# EAGLE design power_supply_board (EAGLE 6.1)
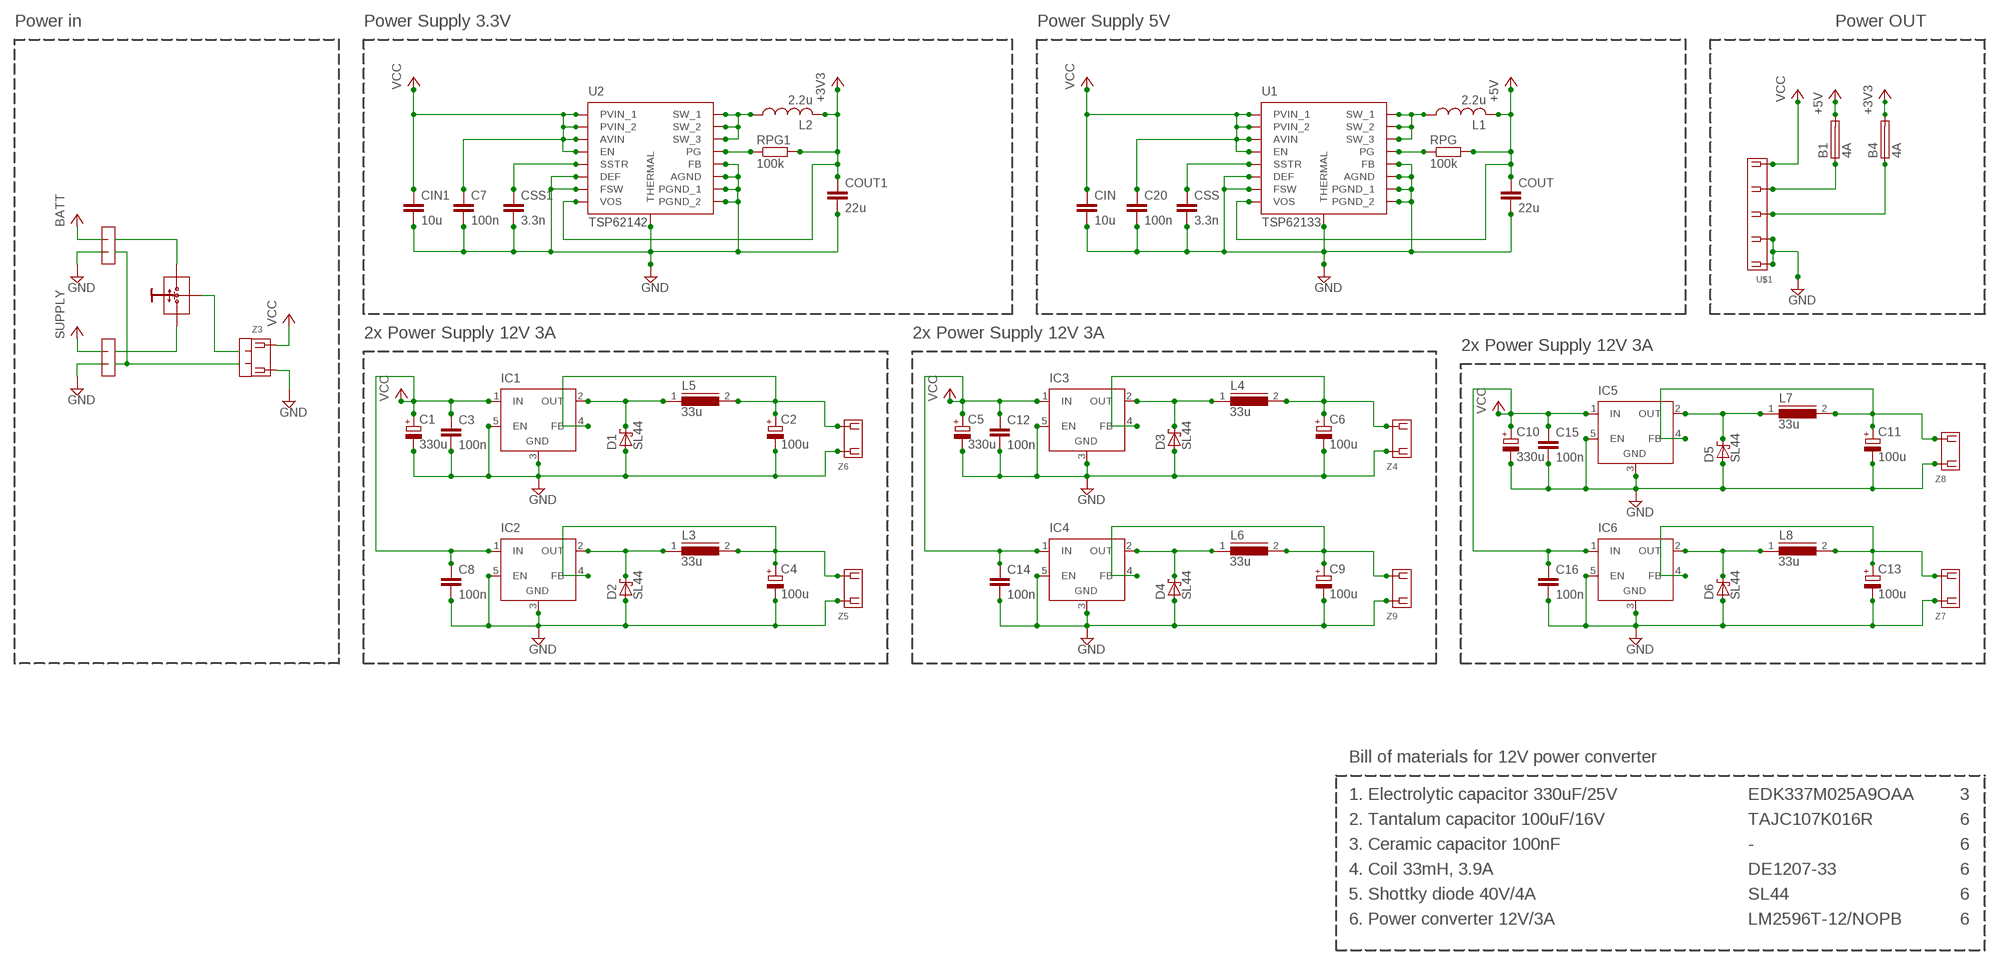
[diagram p0: schematic, sheet 1]

## Parts
B1  4A  FUSE_1206  [1206]
B4  4A  FUSE_1206  [1206]
C1  330u  CPOL-EU150CLZ-1010  [150CLZ-1010]
C2  100u  CPOL-EUSMCC  [SMC_C]
C3  100n  C-EUC0805  [C0805]
C4  100u  CPOL-EUSMCC  [SMC_C]
C5  330u  CPOL-EU150CLZ-1010  [150CLZ-1010]
C6  100u  CPOL-EUSMCC  [SMC_C]
C7  100n  C-EUC0805  [C0805]
C8  100n  C-EUC0805  [C0805]
C9  100u  CPOL-EUSMCC  [SMC_C]
C10  330u  CPOL-EU150CLZ-1010  [150CLZ-1010]
C11  100u  CPOL-EUSMCC  [SMC_C]
C12  100n  C-EUC0805  [C0805]
C13  100u  CPOL-EUSMCC  [SMC_C]
C14  100n  C-EUC0805  [C0805]
C15  100n  C-EUC0805  [C0805]
C16  100n  C-EUC0805  [C0805]
C20  100n  C-EUC0805  [C0805]
CIN  10u  C-EUC0805  [C0805]
CIN1  10u  C-EUC0805  [C0805]
COUT  22u  C-EUC0805  [C0805]
COUT1  22u  C-EUC0805  [C0805]
CSS  3.3n  C-EUC0805  [C0805]
CSS1  3.3n  C-EUC0805  [C0805]
D1  SL44  SCHOTTKY-DIODESMC  [SMC]
D2  SL44  SCHOTTKY-DIODESMC  [SMC]
D3  SL44  SCHOTTKY-DIODESMC  [SMC]
D4  SL44  SCHOTTKY-DIODESMC  [SMC]
D5  SL44  SCHOTTKY-DIODESMC  [SMC]
D6  SL44  SCHOTTKY-DIODESMC  [SMC]
IC1  LM2596TV  [TO220-51]
IC2  LM2596TV  [TO220-51]
IC3  LM2596TV  [TO220-51]
IC4  LM2596TV  [TO220-51]
IC5  LM2596TV  [TO220-51]
IC6  LM2596TV  [TO220-51]
L1  2.2u  L-USWE-TPC  [POWER-CHOKE_WE-TPC]
L2  2.2u  L-USWE-TPC  [POWER-CHOKE_WE-TPC]
L3  33u  DR127  [DR127]
L4  33u  DR127  [DR127]
L5  33u  DR127  [DR127]
L6  33u  DR127  [DR127]
L7  33u  DR127  [DR127]
L8  33u  DR127  [DR127]
RPG  100k  R-EU_R0805  [R0805]
RPG1  100k  R-EU_R0805  [R0805]
U1  TSP62133  [TSP62133]
U2  TSP62142  [TSP62142]
U$1  MOLEX-5268-05  [MOLEX-5268-05]
Z3  2EDGRC-5  [2EDGRC-5]
Z4  MOLEX-5268-02  [MOLEX-5268-02]
Z5  MOLEX-5268-02  [MOLEX-5268-02]
Z6  MOLEX-5268-02  [MOLEX-5268-02]
Z7  MOLEX-5268-02  [MOLEX-5268-02]
Z8  MOLEX-5268-02  [MOLEX-5268-02]
Z9  MOLEX-5268-02  [MOLEX-5268-02]

## Nets
12V3A_1: C2.+ IC1.4(FB) L5.2 Z6.P$2
12V3A_2: C4.+ IC2.4(FB) L3.2 Z5.P$2
12V3A_3: C6.+ IC3.4(FB) L4.2 Z4.P$2
12V3A_4: C9.+ IC4.4(FB) L6.2 Z9.P$2
12V3A_5: C11.+ IC5.4(FB) L7.2 Z8.P$2
12V3A_6: C13.+ IC6.4(FB) L8.2 Z7.P$2
+3V3: B4.2 COUT1.1 L2.2 RPG1.2 U2.VOS
+5V: B1.2 COUT.1 L1.2 RPG.2 U1.VOS
GND: C1.- C2.- C3.2 C4.- C5.- C6.- C7.2 C8.2 C9.- C10.- C11.- C12.2 C13.- C14.2 C15.2 C16.2 C20.2 CIN1.2 CIN.2 COUT1.2 COUT.2 CSS1.2 CSS.2 D1.A D2.A D3.A D4.A D5.A D6.A IC1.3(GND) IC1.5(EN) IC2.3(GND) IC2.5(EN) IC3.3(GND) IC3.5(EN) IC4.3(GND) IC4.5(EN) IC5.3(GND) IC5.5(EN) IC6.3(GND) IC6.5(EN) U1.AGND U1.DEF U1.FB U1.FSW U1.PGND_1 U1.PGND_2 U1.THERMAL U2.AGND U2.DEF U2.FB U2.FSW U2.PGND_1 U2.PGND_2 U2.THERMAL U$1.P$1 U$1.P$2 Z3.P$2 Z4.P$1 Z5.P$1 Z6.P$1 Z7.P$1 Z8.P$1 Z9.P$1
N$1: CSS.1 U1.SSTR
N$2: L2.1 U2.SW_1 U2.SW_2 U2.SW_3
N$3: RPG1.1 U2.PG
N$4: CSS1.1 U2.SSTR
N$5: D2.C IC2.2(OUT) L3.1
N$6: D3.C IC3.2(OUT) L4.1
N$7: L1.1 U1.SW_1 U1.SW_2 U1.SW_3
N$8: D4.C IC4.2(OUT) L6.1
N$9: RPG.1 U1.PG
N$10: D5.C IC5.2(OUT) L7.1
N$11: D6.C IC6.2(OUT) L8.1
N$30: D1.C IC1.2(OUT) L5.1
N$39: B1.1 U$1.P$4
N$42: B4.1 U$1.P$3
VCC: C1.+ C3.1 C5.+ C7.1 C8.1 C10.+ C12.1 C14.1 C15.1 C16.1 C20.1 CIN1.1 CIN.1 IC1.1(IN) IC2.1(IN) IC3.1(IN) IC4.1(IN) IC5.1(IN) IC6.1(IN) U1.AVIN U1.EN U1.PVIN_1 U1.PVIN_2 U2.AVIN U2.EN U2.PVIN_1 U2.PVIN_2 U$1.P$5 Z3.P$1 ; supply symbol labelled BATT, SUPPLY

## Notes on the sheet
- Power in | Power Supply 3.3V | Power Supply 5V | Power OUT
- 2x Power Supply 12V 3A | 2x Power Supply 12V 3A
- 2x Power Supply 12V 3A
- Bill of materials for 12V power converter
- 1. Electrolytic capacitor 330uF/25V | EDK337M025A9OAA | 3
- 2. Tantalum capacitor 100uF/16V | TAJC107K016R | 6
- 3. Ceramic capacitor 100nF | - | 6
- 4. Coil 33mH, 3.9A | DE1207-33 | 6
- 5. Shottky diode 40V/4A | SL44 | 6
- 6. Power converter 12V/3A | LM2596T-12/NOPB | 6

## Library data of the parts
B1 B4 = FUSE_SMD:FUSE_1206
C1 C2 C4-C6 C9-C11 C13 = rcl:CPOL-EU: POLARIZED CAPACITOR, European symbol
C3 C7 C8 C12 C14-C16 C20 CIN CIN1 COUT COUT1 CSS CSS1 = rcl:C-EU: CAPACITOR, European symbol
D1-D6 = diode:SCHOTTKY-DIODE: Schottky Diode
IC1-IC6 = linear:LM2596T: STEP-DOWN VOLTAGE REGULATOR
L1 L2 = rcl:L-US: INDUCTOR, American symbol
L3-L8 = inductors:DR127: High Power Density, High Efficiency, Shielded Inductors Source: coiltronics_dr_series.pdf
RPG RPG1 = rcl:R-EU_: RESISTOR, European symbol
U1 = !tsp:TSP62133
U2 = !tsp:TSP62142
U$1 = MOLEX-5268:MOLEX-5268-05
Z3 = 2EDGRC-5:2EDGRC-5
Z4-Z9 = MOLEX-5268:MOLEX-5268-02

## Board
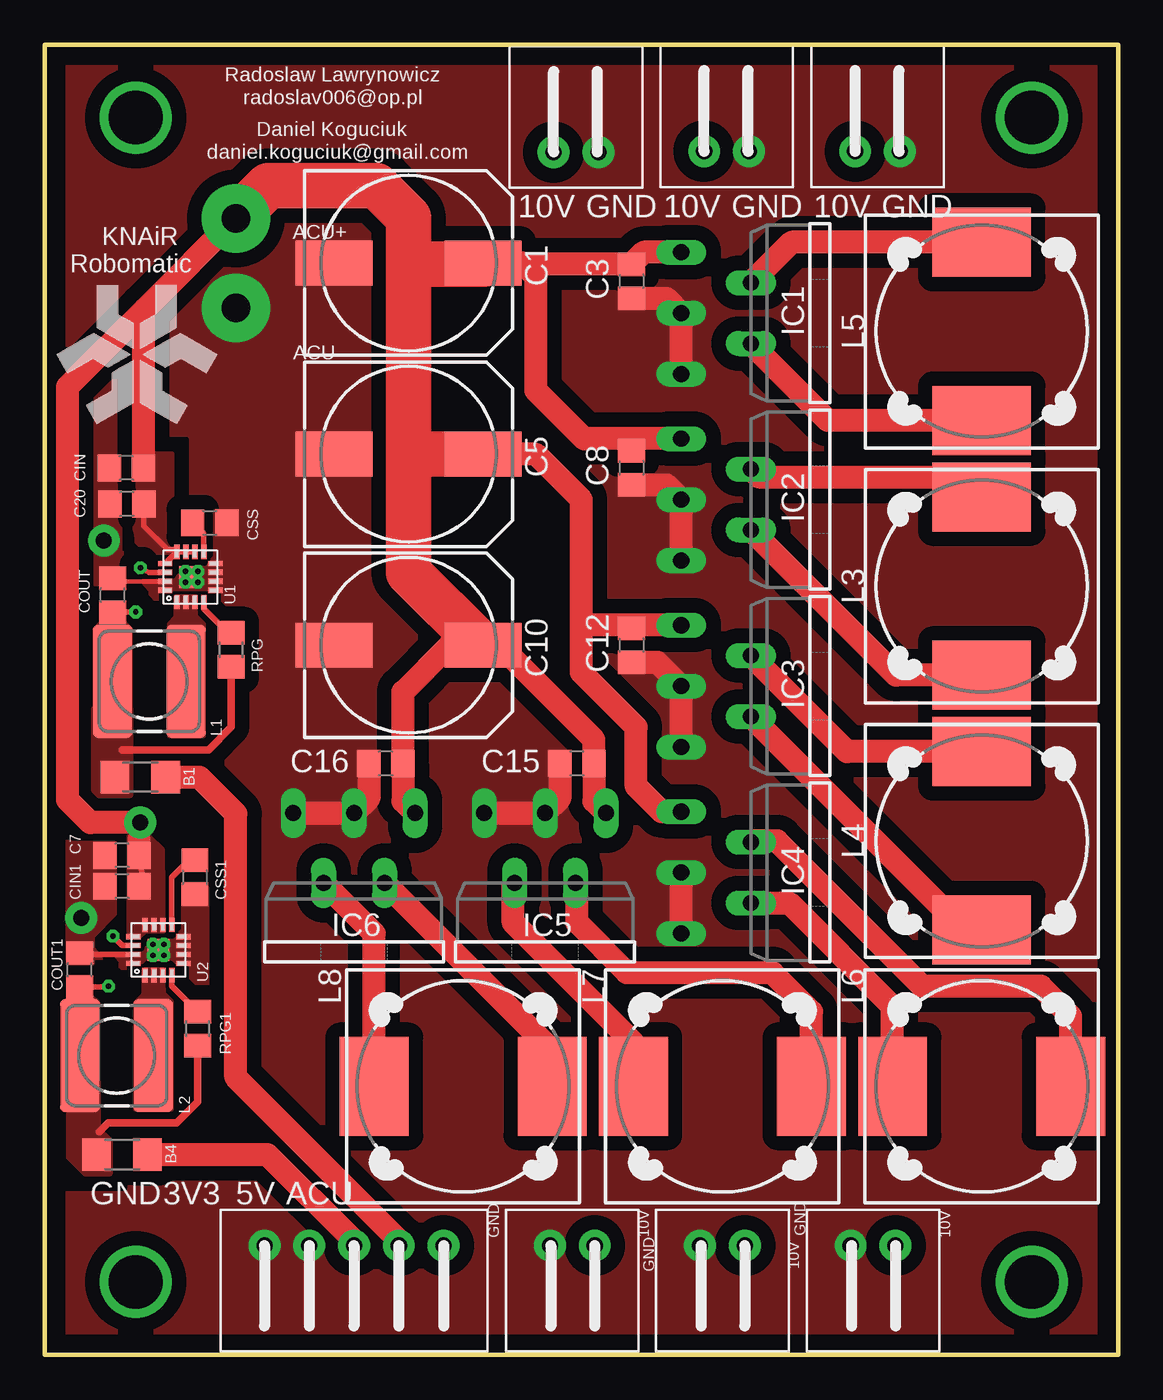
[diagram p1: board, top side]
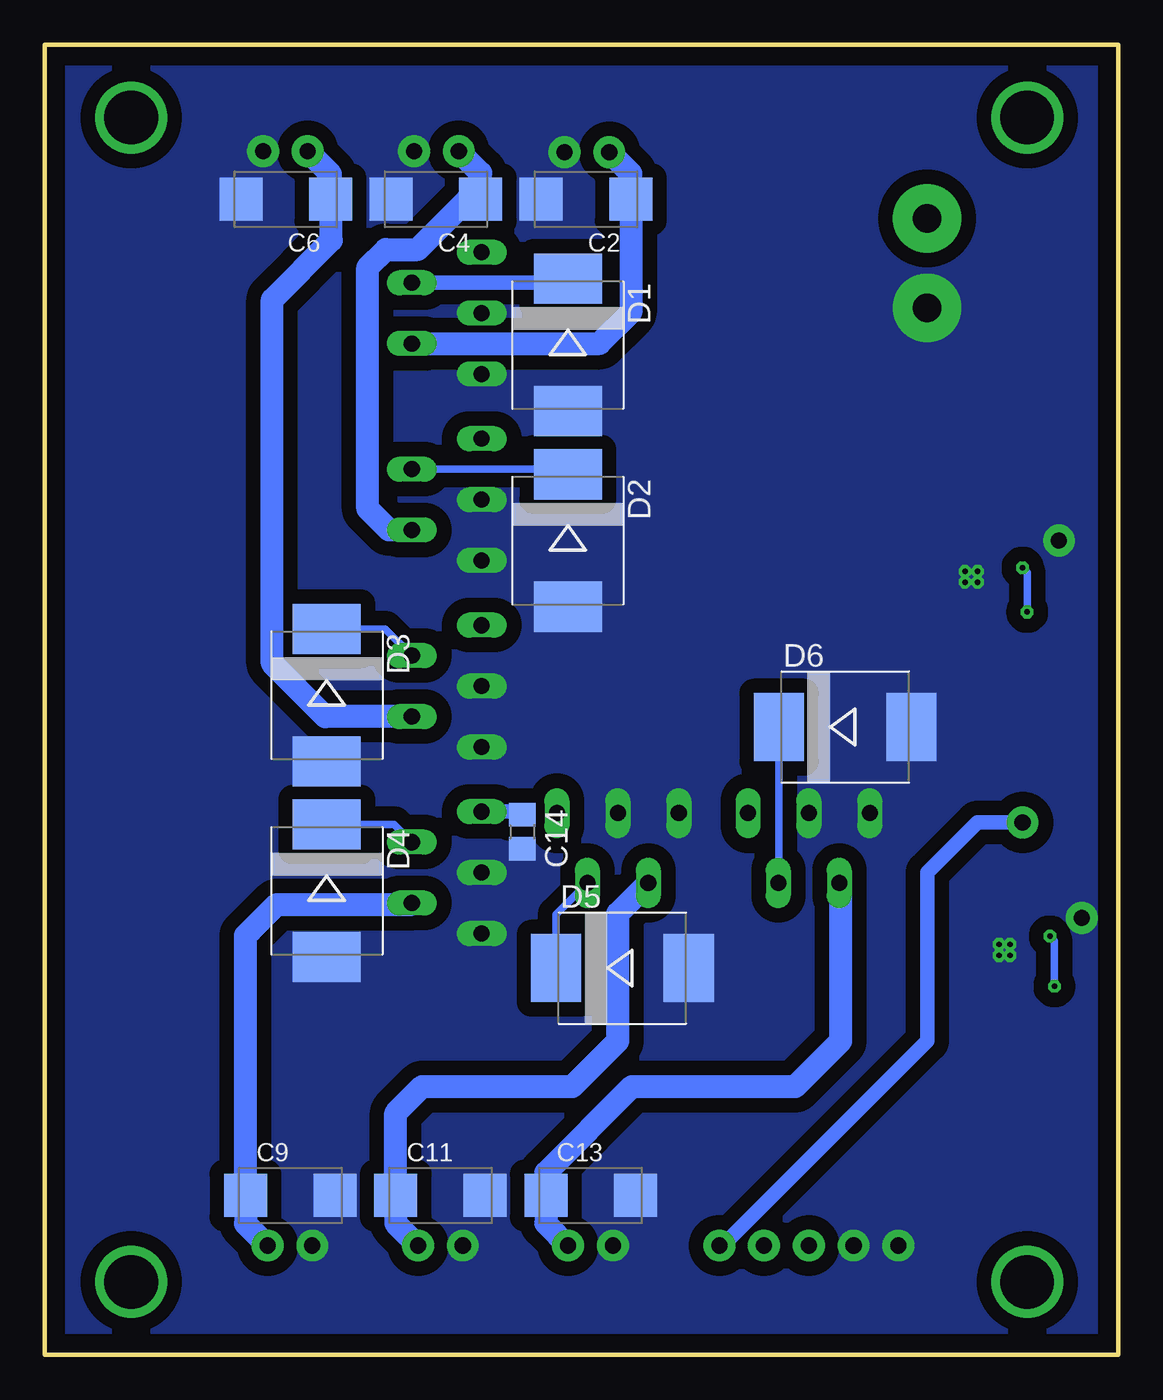
[diagram p2: board, bottom side, seen from below]

Size 59.94 x 73.15 mm. Coordinates in mm from the lower left corner, seen from the top.
Outline: 59.94,73.15 0,73.15 0,0 59.94,0 59.94,73.15
Copper layers (1*16): Top 0.035mm / dielectric 1.5mm / Bottom 0.035mm
Design rules: minimum track width 10mil, minimum drill 24mil, track to track 8mil, track to pad 8mil, pad to pad 8mil, via to via 8mil, smd to smd 8mil, copper to edge 40mil, drill to drill 8mil, minimum pad ring 10mil, minimum via ring 8mil, stop-mask expansion 4mil, vias tented up to drill 0mil, thermal gap 10mil

### Footprints (pad centres in the part's own frame; a part is rotated, then mirrored left to right if it is on the bottom)
1206 = smd 1.6 x 1.803: 1 -1.422,0; 2 1.422,0
150CLZ-1010 = smd 4.3 x 2.5: + 4.15,0; - -4.15,0
SMC_C = smd 2.4 x 2.4: + -2.5,0; - 2.5,0
C0805 = smd 1.3 x 1.5: 1 -0.95,0; 2 0.95,0
SMC = smd 2.8 x 3.8: A 3.7,0; C -3.7,0
TO220-51 = drill 0.9 long: 1 -3.4,-8.4; 2 -1.7,-4.5; 3 0,-8.4; 4 1.7,-4.5; 5 3.4,-8.4
POWER-CHOKE_WE-TPC = smd 6.3 x 2.2: 1 0,2.05; 2 0,-2.05
DR127 = smd 3.85 x 5.5: 1 -4.975,0; 2 4.975,0
R0805 = smd 1.3 x 1.5: 1 -0.95,0; 2 0.95,0
TSP62133 = smd 0.3 x 0.8: AGND -0.25,-1.4; DEF 0.75,-1.4; EN 0.75,1.4; FB -0.75,-1.4; FSW 0.25,-1.4; PGND_1 -0.75,1.4; PGND_2 -0.25,1.4; VOS 0.25,1.4 | smd 0.8 x 0.3: AVIN 1.4,-0.25; PG -1.4,-0.75; PVIN_1 1.4,0.75; PVIN_2 1.4,0.25; SSTR 1.4,-0.75; SW_1 -1.4,-0.25; SW_2 -1.4,0.25; SW_3 -1.4,0.75 | smd 1.22 x 1.22: THERMAL 0,0
TSP62142 = smd 0.3 x 0.8: AGND -0.25,-1.4; DEF 0.75,-1.4; EN 0.75,1.4; FB -0.75,-1.4; FSW 0.25,-1.4; PGND_1 -0.75,1.4; PGND_2 -0.25,1.4; VOS 0.25,1.4 | smd 0.8 x 0.3: AVIN 1.4,-0.25; PG -1.4,-0.75; PVIN_1 1.4,0.75; PVIN_2 1.4,0.25; SSTR 1.4,-0.75; SW_1 -1.4,-0.25; SW_2 -1.4,0.25; SW_3 -1.4,0.75 | smd 1.22 x 1.22: THERMAL 0,0
MOLEX-5268-05 = drill 0.9 pad 1.778: P$1 0,5; P$2 0,2.5; P$3 0,0; P$4 0,-2.5; P$5 0,-5
2EDGRC-5 = drill 1.6 pad 3.81: P$1 0,2.5; P$2 0,-2.5
MOLEX-5268-02 = drill 0.9 pad 1.778: P$1 0,1.25; P$2 0,-1.25

### Placement (x,y rotation side)
B1  5.33,32.26 180 top
B4  4.32,11.18 180 top
C1  20.32,60.96 0 top
C2  29.72,64.52 180 bottom
C3  32.77,59.94 270 top
C4  38.1,64.52 180 bottom
C5  20.32,50.29 0 top
C6  46.48,64.52 180 bottom
C7  4.32,26.16 180 top
C8  32.77,49.53 270 top
C9  46.23,8.89 0 bottom
C10  20.32,39.62 0 top
C11  37.85,8.89 0 bottom
C12  32.77,39.62 270 top
C13  29.46,8.89 0 bottom
C14  33.27,29.21 270 bottom
C15  29.72,33.02 180 top
C16  19.05,33.02 180 top
C20  4.59,47.5 180 top
CIN  4.56,49.52 180 top
CIN1  4.32,27.89 180 top
COUT  3.8,42.42 90 top
COUT1  1.96,21.49 90 top
CSS  9.21,46.46 0 top
CSS1  8.38,26.67 270 top
D1  30.73,56.39 270 bottom
D2  30.73,45.47 270 bottom
D3  44.2,36.83 270 bottom
D4  44.2,25.91 270 bottom
D5  27.69,21.59 0 bottom
D6  15.24,35.05 0 bottom
IC1  43.94,58.17 270 top
IC2  43.94,47.75 270 top
IC3  43.94,37.34 270 top
IC4  43.94,26.92 270 top
IC5  27.94,21.84 180 top
IC6  17.27,21.84 180 top
L1  5.84,37.6 270 top
L2  4.01,16.71 270 top
L3  52.32,42.93 270 top
L4  52.32,28.7 270 top
L5  52.32,57.15 270 top
L6  52.32,14.99 180 top
L7  37.85,14.99 180 top
L8  23.37,14.99 180 top
RPG  10.41,39.37 270 top
RPG1  8.54,18.21 270 top
U1  8.13,43.43 90 top
U2  6.35,22.61 90 top
U$1  17.27,6.1 90 top
Z3  10.67,60.96 0 top
Z4  46.51,67.21 270 top
Z5  38.07,67.21 270 top
Z6  29.67,67.16 270 top
Z7  29.46,6.1 90 top
Z8  37.85,6.1 90 top
Z9  46.25,6.1 90 top

### Tracks (layer width: path | path; a pad name or v marks a point on that pad's centre or on a via)
12V3A_1
  Top 1.27: L5.2 43.73,52.17 IC1.4
  Bottom 1.27: Z6.P$2 27.22,65.96 C2.+ 27.22,58.21 28.96,56.47 IC1.4
12V3A_2
  Top 1.27: L3.2 47.54,37.95 IC2.4
  Bottom 0.813: C4.+ 35.6,64.48
  Bottom 1.27: IC2.4 40.72,46.05 41.91,47.24 41.91,60.71 40.89,61.72 39.12,61.72 36.36,64.48 35.6,64.48 | C4.+ 35.6,65.98 Z5.P$2
12V3A_3
  Top 0.813: L4.2 51.35,23.73
  Top 1.27: 51.35,23.73 IC3.4
  Bottom 0.813: 43.98,62.27 43.94,62.23
  Bottom 1.27: IC3.4 44.27,35.64 47.24,38.61 47.24,58.93 43.94,62.23 | 43.98,62.27 C6.+ 43.98,65.93 Z4.P$2
12V3A_4
  Top 1.27: L6.2 47.35,19.45 41.58,25.22 IC4.4
  Bottom 0.813: 39.52,25.15 IC4.4
  Bottom 1.27: 39.52,25.15 46.99,25.15 48.13,24 48.47,23.66 48.73,23.41 C9.+ 48.73,7.32 Z9.P$2
12V3A_5
  Top 0.813: 26.16,26.27 IC5.4
  Top 1.27: L7.2 32.87,17.42 26.16,24.13 26.16,26.27
  Bottom 1.27: IC5.4 27.94,24.64 27.94,17.53 30.48,14.99 38.86,14.99 40.35,13.5 C11.+ 40.35,7.35 Z8.P$2
12V3A_6
  Top 1.27: L8.2 18.39,23.52 IC6.4
  Bottom 0.813: 15.49,26.27 IC6.4
  Bottom 1.27: 15.49,26.27 15.49,17.53 18.03,14.99 27.14,14.99 31.96,10.16 C13.+ 31.96,7.35 Z7.P$2
+3V3  (via drill 0.3 pad 0.61)
  Top 0.305: 1.96,16.34 L2.2 | U2.VOS 4.32,22.86 v3.81,23.37 | v3.56,20.57 3.52,20.54 COUT1.1
  Top 0.406: RPG1.2 8.54,14.13 7.37,12.95 3.56,12.95 3.05,12.45
  Bottom 0.406: v3.56,20.57 3.56,23.11 v3.81,23.37
  pour Top (no thermals): 2.59,21.11 2.59,20.02 2.97,19.63 2.97,13.67 0.97,13.67 0.97,19.63 1.32,19.99 1.32,21.11
  pour Top (no thermals): 1.02,15.24 2.92,15.24 2.92,12.6 3.61,11.94 3.61,10.16 2.29,10.16 1.02,11.43
+5V  (via drill 0.3 pad 0.61)
  Top 0.254: 3.8,38.12 L1.2
  Top 0.305: U1.VOS 5.84,43.69 v5.33,43.94 | v5.08,41.48 COUT.1
  Top 0.406: RPG.2 10.41,35.05 9.14,33.78 4.32,33.78
  Bottom 0.406: v5.08,41.48 5.08,43.69 v5.33,43.94
  pour Top (no thermals): 4.42,42.01 4.42,40.92 4.8,40.54 4.8,34.57 2.79,34.57 2.79,40.54 3.15,40.89 3.15,42.01
  pour Top (no thermals): 2.79,36.07 4.75,36.07 4.75,31.29 3.05,31.29 2.79,31.55
GND  (via drill 0.3 pad 0.61, 0.89 pad 1.78, 0.9 pad 1.78)
  Top 0.254: 3.8,43.19 COUT.2 3.98,43.19 U1.PGND_2 | v7.85,43.14 v7.85,43.74
  Top 0.305: COUT1.2 1.96,22.36 U2.PGND_2
  Top 1.27: IC1.5 IC1.3 34.71,58.99 C3.2 | IC2.5 IC2.3 34.71,48.58 C8.2 | IC4.3 IC4.5 | IC5.5 IC5.3 28.77,31.07 C15.2 | IC6.5 IC6.3 18.1,31.07 C16.2 | C12.2 34.21,38.67 IC3.3 IC3.5
  other vias: 8.55,43.74 8.55,43.14 6.65,22.3 6.65,22.91 6.05,22.3 6.05,22.91 2.03,24.38 3.3,45.47
  pour Top (isolate 0.813, no thermals): 4.22,50.32 4.22,44.83 4.45,44.7 4.45,42.67 2.54,42.67 2.54,50.29
  pour Top (no thermals): 7.65,43.94 7.65,43.66 7.21,43.21 5.44,43.21 5.92,42.67 9.19,42.65 10.79,42.65 10.79,47.12 9.53,47.12 9.53,44.55 9.25,44.27 9.25,44.15 9.04,43.94
  pour Top (no thermals): 3.91,28.57 3.91,24.61 2.67,23.37 2.67,21.84 0.76,21.84 0.69,21.92 0.69,28.57
  pour Top (no thermals): 5.84,23.11 5.84,22.83 5.41,22.38 3.89,22.38 4.37,21.84 5.33,21.84 5.61,22.12 7.14,22.12 7.44,21.82 8.99,21.82 8.99,26.29 7.72,26.29 7.72,23.72 7.44,23.44 7.44,23.32 7.24,23.11
  pour Bottom (isolate 0.813, rank 2, no thermals): 0,73.15 0,0 59.94,0 59.94,73.15
  pour Top (isolate 0.813, rank 2, no thermals): 0,73.15 0,0 59.94,0 59.94,73.15
H1  (via drill 3)
  other vias: 55.12,69.09
H2  (via drill 3)
  other vias: 5.08,69.09
H3  (via drill 3)
  other vias: 5.08,4.06
H4  (via drill 3)
  other vias: 55.12,4.06
N$1
  Top 0.305: U1.SSTR 8.88,45.85 CSS.1
N$2
  Top 0.305: L2.1 6.1,16.64
  pour Top (no thermals): 7.09,13.72 7.09,19.74 6.65,20.17 6.65,21.51 5.54,21.51 5.54,20.12 5.05,19.63 5.05,13.72
N$3
  Top 0.305: U2.PG 7.1,20.6 RPG1.1
N$4
  Top 0.305: U2.SSTR 7.1,26.66 7.87,27.43 8.19,27.43 CSS1.1
N$5
  Top 0.813: L3.1 51.67,47.9 51.18,48.39 | 50.04,49.02 50.55,49.02
  Top 1.27: IC2.2 39.88,49.02 50.55,49.02 51.18,48.39
  Bottom 0.406: IC2.2 31.02,49.45 D2.C
N$6
  Top 1.27: L4.1 44.8,33.68 IC3.2
  Bottom 0.406: D3.C 40.93,40.53 IC3.2
N$7
  Top 0.406: 7.88,37.8 L1.1
  pour Top (no thermals): 8.86,34.54 8.86,40.82 8.43,41.25 8.43,42.34 7.32,42.34 7.32,41.2 6.93,40.82 6.93,34.54
N$8
  Top 0.813: 39.52,28.7 IC4.2
  Top 1.27: L6.1 57.3,18.9 55.63,20.57 49.02,20.57 40.89,28.7 39.52,28.7
  Bottom 0.406: D4.C 40.43,29.61 IC4.2
N$9
  Top 0.305: U1.PG 8.88,41.67 9.91,40.64 10.09,40.64 RPG.1
N$10
  Top 0.813: 29.72,26.27 IC5.2
  Top 1.27: L7.1 42.82,19.16 40.64,21.34 32.51,21.34 29.72,24.13 29.72,26.27
  Bottom 0.406: D5.C 31.39,24.6 IC5.2
N$11
  Top 1.27: L8.1 28.34,16.97 IC6.2
  Bottom 0.406: D6.C 18.94,26.38 IC6.2
N$30
  Top 1.27: L5.1 41.7,62.12 IC1.2
  Bottom 0.813: IC1.2 30.96,59.87 D1.C
N$39
  Top 1.27: B1.1 8.64,32.26 10.67,30.23 10.67,15.49 19.77,6.39 U$1.P$4
N$42
  Top 1.27: B4.1 12.45,11.18 17.27,6.35 U$1.P$3
VCC  (via drill 0.9 pad 1.78)
  Top 0.305: 5.6,25.78 CIN1.1 | U1.AVIN 8.01,44.84 7.88,44.71 | U1.EN U1.PVIN_1 | U1.PVIN_1 U1.PVIN_2 7.88,44.71 | 7.88,44.71 7.87,44.7 | C20.1 5.54,46.28 6.86,44.96 7.37,44.96 7.38,44.95 U1.PVIN_1
  Top 0.813: 22.61,39.62 24.38,39.62 C10.+ 25.4,39.62 26.16,39.62 | 30.13,40.74 29.97,40.89 | 24.54,60.89 C1.+ | C8.1 32.77,50.9 32.51,51.15
  Top 1.016: 5.61,58.4 5.74,58.53 | 1.27,53.94 1.27,54.06
  Top 1.27: 1.27,53.94 1.27,30.99 2.54,29.72 v5.33,29.72 | CIN1.1 5.27,28.77 | IC1.1 33.44,61.57 C3.1 23.88,60.89 | IC6.1 20,30.92 C16.1 20,37.02 22.61,39.62 | IC5.1 30.67,30.92 C15.1 30.67,34.36 25.4,39.62 | IC3.1 32.77,40.74 | 32.77,40.74 30.13,40.74 | C12.1 32.77,40.74 | IC4.1 34.45,30.32 33.02,31.75 33.02,35.05 29.97,38.1 29.97,40.89 29.97,47.75 27.43,50.29 24.13,50.29 | IC2.1 32.51,51.15 30.13,51.15 27.43,53.85 27.43,60.2 26.67,60.96 C1.+ | 5.74,58.53 Z3.P$1 | 1.27,54.06 5.51,58.3 | CIN.1 5.51,58.3 | 5.51,58.3 5.61,58.4
  Top 2.54: 24.38,39.62 20.32,43.69 20.32,50.29 | 24.54,60.89 23.88,60.89 20.39,60.89 20.32,60.96 | 20.32,50.29 20.32,60.96 | 20.32,60.96 20.32,63.5 18.54,65.28 12.49,65.28 Z3.P$1 | C5.+ 24.13,50.29 20.32,50.29
  Bottom 0.813: C14.1 33.44,30.32 IC4.1 | U$1.P$5 22.1,6.1 10.67,17.53 10.67,26.92 7.87,29.72 v5.33,29.72
  pour Top (isolate 0.813, no thermals): 7.11,50.32 4.95,50.32 4.98,45.54 6.4,44.12 7.04,44.12 7.42,44.5 8.41,44.5 8.41,45.21 7.37,45.21 7.11,45.47
  pour Top (no thermals): 6.58,28.22 5.84,28.96 4.67,28.98 4.67,23.29 5.26,23.29 5.61,23.65 6.63,23.65

### Text on the board
tPlace: Radoslaw Lawrynowicz | radoslav006@op.pl | Daniel Koguciuk | daniel.koguciuk@gmail.com | 10V | GND | 10V | GND | 10V | GND | KNAiR | ACU+ | Robomatic | ACU- | U1 | U2 | GND | 3V3 | 5V | ACU | GND | 10V | GND | 10V | GND | 10V